# EAGLE design robocoon (EAGLE 9.5.2)
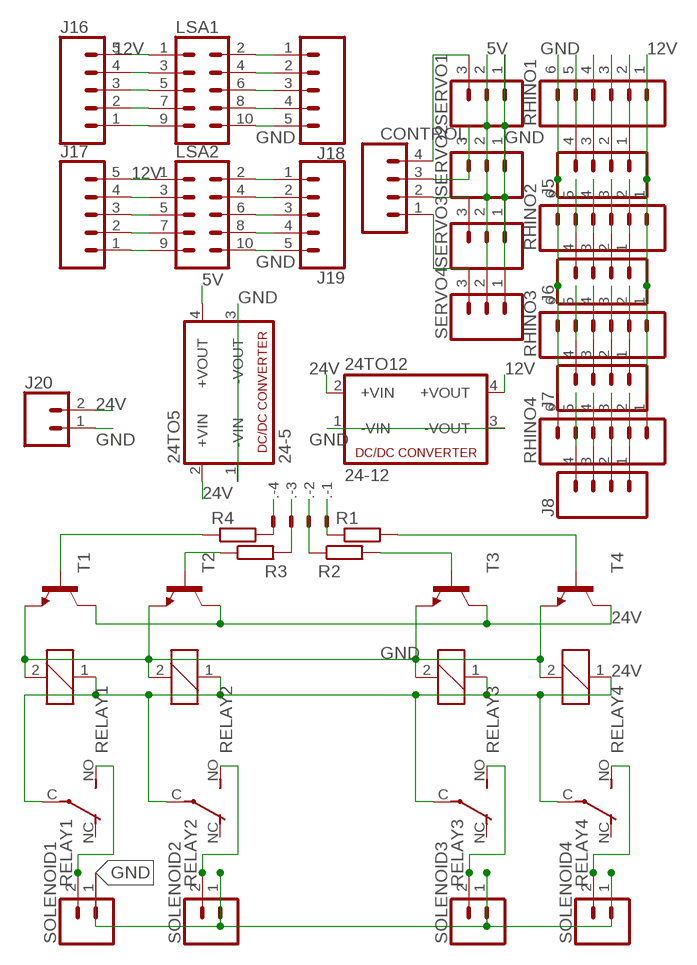
[diagram p0: schematic, sheet 1]

## Parts
24TO5  24-5  NME  [NME]
24TO12  24-12  NME  [NME]
.  22-23-2041  [22-23-2041]
CONTROL  CONN_04  [1X04]
J5  CONN_04  [1X04]
J6  CONN_04  [1X04]
J7  CONN_04  [1X04]
J8  CONN_04  [1X04]
J16  CONN_05SCREW  [SCREWTERMINAL-3.5MM-5]
J17  CONN_05SCREW  [SCREWTERMINAL-3.5MM-5]
J18  CONN_05SCREW  [SCREWTERMINAL-3.5MM-5]
J19  CONN_05SCREW  [SCREWTERMINAL-3.5MM-5]
J20  CONN_023.5MM  [SCREWTERMINAL-3.5MM-2]
LSA1  CONN_05X2PTH  [2X5]
LSA2  CONN_05X2PTH  [2X5]
R1  R-EU_0204/2V  [0204V]
R2  R-EU_0204/2V  [0204V]
R3  R-EU_0204/2V  [0204V]
R4  R-EU_0204/2V  [0204V]
RELAY1  CQ1-12V  [CQ1]
RELAY2  CQ1-12V  [CQ1]
RELAY3  CQ1-12V  [CQ1]
RELAY4  CQ1-12V  [CQ1]
RHINO1  CONN_06NO_SILK_FEMALE_PTH  [1X06_NO_SILK]
RHINO2  CONN_06NO_SILK_FEMALE_PTH  [1X06_NO_SILK]
RHINO3  CONN_06NO_SILK_FEMALE_PTH  [1X06_NO_SILK]
RHINO4  CONN_06NO_SILK_FEMALE_PTH  [1X06_NO_SILK]
SERVO1  CONN_03SCREW  [SCREWTERMINAL-3.5MM-3]
SERVO2  CONN_03SCREW  [SCREWTERMINAL-3.5MM-3]
SERVO3  CONN_03SCREW  [SCREWTERMINAL-3.5MM-3]
SERVO4  CONN_03SCREW  [SCREWTERMINAL-3.5MM-3]
SOLENOID1  CONN_023.5MM  [SCREWTERMINAL-3.5MM-2]
SOLENOID2  CONN_023.5MM  [SCREWTERMINAL-3.5MM-2]
SOLENOID3  CONN_023.5MM  [SCREWTERMINAL-3.5MM-2]
SOLENOID4  CONN_023.5MM  [SCREWTERMINAL-3.5MM-2]
T1  -NPN-TO92  [TO92]
T2  -NPN-TO92  [TO92]
T3  -NPN-TO92  [TO92]
T4  -NPN-TO92  [TO92]

## Nets
5V: 24TO5.4(+VOUT) SERVO1.2 SERVO2.2 SERVO3.2 SERVO4.2
12V: 24TO12.4(+VOUT) J16.5 J17.5 LSA1.1 LSA2.1 RHINO1.1 RHINO2.1 RHINO3.1 RHINO4.1
24V: 24TO5.2(+VIN) 24TO12.2(+VIN) J20.2 RELAY1.1 RELAY1.C(2:P) RELAY2.1 RELAY2.C(2:P) RELAY3.1 RELAY3.C(2:P) RELAY4.1 RELAY4.C(2:P) T1.3(C) T2.3(C) T3.3(C) T4.3(C)
GND: 24TO5.1(-VIN) 24TO5.3(-VOUT) 24TO12.1(-VIN) 24TO12.3(-VOUT) J18.5 J19.5 J20.1 LSA1.10 LSA2.10 RELAY1.2 RELAY2.2 RELAY3.2 RELAY4.2 RHINO1.6 RHINO2.6 RHINO3.6 RHINO4.6 SERVO1.1 SERVO2.1 SERVO3.1 SERVO4.1 SOLENOID1.1 SOLENOID2.1 SOLENOID3.1 SOLENOID4.1 T1.1(E) T2.1(E) T3.1(E) T4.1(E)
N$1: J5.4 RHINO1.5
N$2: J5.3 RHINO1.4
N$3: J5.2 RHINO1.3
N$4: J5.1 RHINO1.2
N$5: J6.4 RHINO2.5
N$6: J6.3 RHINO2.4
N$7: J6.2 RHINO2.3
N$8: J6.1 RHINO2.2
N$9: J7.1 RHINO3.2
N$10: J7.2 RHINO3.3
N$11: J7.3 RHINO3.4
N$12: J7.4 RHINO3.5
N$13: J8.1 RHINO4.2
N$14: J8.2 RHINO4.3
N$15: J8.3 RHINO4.4
N$16: J8.4 RHINO4.5
N$17: CONTROL.4 SERVO1.3
N$18: CONTROL.1 SERVO4.3
N$19: CONTROL.2 SERVO3.3
N$20: CONTROL.3 SERVO2.3
N$25: ..4 R4.2
N$28: ..3 R3.2
N$29: ..2 R2.1
N$30: ..1 R1.1
N$31: J16.1 LSA1.9
N$32: R4.1 T1.2(B)
N$33: R3.1 T2.2(B)
N$34: J16.2 LSA1.7
N$35: R2.2 T3.2(B)
N$36: R1.2 T4.2(B)
N$37: J16.3 LSA1.5
N$38: J16.4 LSA1.3
N$40: J18.1 LSA1.2
N$41: J18.2 LSA1.4
N$43: J18.3 LSA1.6
N$44: J18.4 LSA1.8
N$47: RELAY1.NO(2:S) SOLENOID1.2
N$48: RELAY2.NO(2:S) SOLENOID2.2
N$49: RELAY3.NO(2:S) SOLENOID3.2
N$50: RELAY4.NO(2:S) SOLENOID4.2
N$51: J17.4 LSA2.3
N$52: J17.3 LSA2.5
N$53: J17.2 LSA2.7
N$54: J17.1 LSA2.9
N$55: J19.1 LSA2.2
N$56: J19.2 LSA2.4
N$57: J19.3 LSA2.6
N$58: J19.4 LSA2.8
Unconnected: RELAY1.NC(2:O) RELAY2.NC(2:O) RELAY3.NC(2:O) RELAY4.NC(2:O)

## Library data of the parts
24TO5 24TO12 = dc-dc-converter:NME: DC-DC CONVERTER; MF: C & D TECHNOLOGIES, INC; MPN: NME1205D; OC_FARNELL: 1021466; OC_NEWARK: 98B8198
. = con-molex:22-23-2041: .100" (2.54mm) Center Header - 4 Pin; MF: MOLEX; MPN: 22-23-2041; OC_FARNELL: 1462920; OC_NEWARK: 38C0355
CONTROL J5-J8 = SparkFun-Connectors:CONN_04: Multi connection point. Often used as Generic Header-pin footprint for 0.1 inch spaced/style header connections On any of the 0.1 inch spaced packages, you can populate with these: Break Away Headers - Straight <https://www.sparkfun.com/products/116> (PRT-00116) Break Away Male Headers - Right Angle <https://www.sparkfun.com/products/553> (PRT-00553) Female Headers <https://www.sparkfun.com/products/115> (PRT-00115) Break Away Headers - Machine Pin <https://www.sparkfun.com/products/117> (PRT-00117) Break Away Female Headers - Swiss Machine Pin <https://www.sparkfun.com/products/743> (PRT-00743) For SCREWTERMINALS and SPRING TERMINALS visit here: Screw Terimnals on SparkFun.com <https://www.sparkfun.com/search/results?term=Screw+Terminals> (5mm/3.5mm/2.54mm spacing) This device is also useful as a general connection point to wire up your design to another part of your project. Our various solder wires solder well into these plated through hole pads. Hook-Up Wire - Assortment (Stranded, 22 AWG) <https://www.sparkfun.com/products/11375> (PRT-11375) Hook-Up Wire - Assortment (Solid Core, 22 AWG) <https://www.sparkfun.com/products/11367> (PRT-11367) View the entire wire category on our website here <https://www.sparkfun.com/categories/141> Special notes: Molex polarized connector foot print use with SKU : PRT-08231 with associated crimp pins and housings. 1MM SMD Version SKU: PRT-10208; PROD_ID: CONN-09696
J16-J19 = SparkFun-Connectors:CONN_05: Multi connection point. Often used as Generic Header-pin footprint for 0.1 inch spaced/style header connections On any of the 0.1 inch spaced packages, you can populate with these: Break Away Headers - Straight <https://www.sparkfun.com/products/116> (PRT-00116) Break Away Male Headers - Right Angle <https://www.sparkfun.com/products/553> (PRT-00553) Female Headers <https://www.sparkfun.com/products/115> (PRT-00115) Break Away Headers - Machine Pin <https://www.sparkfun.com/products/117> (PRT-00117) Break Away Female Headers - Swiss Machine Pin <https://www.sparkfun.com/products/743> (PRT-00743) For SCREWTERMINALS and SPRING TERMINALS visit here: Screw Terimnals on SparkFun.com <https://www.sparkfun.com/search/results?term=Screw+Terminals> (5mm/3.5mm/2.54mm spacing) This device is also useful as a general connection point to wire up your design to another part of your project. Our various solder wires solder well into these plated through hole pads. Hook-Up Wire - Assortment (Stranded, 22 AWG) <https://www.sparkfun.com/products/11375> (PRT-11375) Hook-Up Wire - Assortment (Solid Core, 22 AWG) <https://www.sparkfun.com/products/11367> (PRT-11367) View the entire wire category on our website here <https://www.sparkfun.com/categories/141> Special notes: Molex polarized connector foot print use with SKU : PRT-08231 with associated crimp pins and housings. 1MM SMD Version SKU: PRT-10208; PROD_ID: Combine 8288+8399
J20 SOLENOID1-SOLENOID4 = SparkFun-Connectors:CONN_02: Multi connection point. Often used as Generic Header-pin footprint for 0.1 inch spaced/style header connections On any of the 0.1 inch spaced packages, you can populate with these: Break Away Headers - Straight <https://www.sparkfun.com/products/116> (PRT-00116) Break Away Male Headers - Right Angle <https://www.sparkfun.com/products/553> (PRT-00553) Female Headers <https://www.sparkfun.com/products/115> (PRT-00115) Break Away Headers - Machine Pin <https://www.sparkfun.com/products/117> (PRT-00117) Break Away Female Headers - Swiss Machine Pin <https://www.sparkfun.com/products/743> (PRT-00743) For SCREWTERMINALS and SPRING TERMINALS visit here: Screw Terimnals on SparkFun.com <https://www.sparkfun.com/search/results?term=Screw+Terminals> (5mm/3.5mm/2.54mm spacing) This device is also useful as a general connection point to wire up your design to another part of your project. Our various solder wires solder well into these plated through hole pads. Hook-Up Wire - Assortment (Stranded, 22 AWG) <https://www.sparkfun.com/products/11375> (PRT-11375) Hook-Up Wire - Assortment (Solid Core, 22 AWG) <https://www.sparkfun.com/products/11367> (PRT-11367) View the entire wire category on our website here <https://www.sparkfun.com/categories/141> Special notes: Molex polarized connector foot print use with: PRT-08233 with associated crimp pins and housings. 2.54_SCREWTERM for use with PRT-10571. 3.5mm Screw Terminal footprints for PRT-08084 5mm Screw Terminal footprints for use with PRT-08432; PROD_ID: CONN-08399
LSA1 LSA2 = SparkFun-Connectors:CONN_05X2: Multi connection point. Often used as Generic Header-pin footprint for 0.1 inch spaced/style header connections For AVR SPI programming port, see special device with nice symbol: "AVR_SPI_PROG_5x2.dev" You can populate with any combo of single row headers, but if you'd like an exact match, check these: 2x5 AVR ICSP Male Header <https://www.sparkfun.com/products/778> (PRT-00778) 2x5 Pin Shrouded Header <https://www.sparkfun.com/products/8506> (PRT-08506) On any of the 0.1 inch spaced packages, you can populate with these: Break Away Headers - Straight <https://www.sparkfun.com/products/116> (PRT-00116) Break Away Male Headers - Right Angle <https://www.sparkfun.com/products/553> (PRT-00553) Female Headers <https://www.sparkfun.com/products/115> (PRT-00115) Break Away Headers - Machine Pin <https://www.sparkfun.com/products/117> (PRT-00117) Break Away Female Headers - Swiss Machine Pin <https://www.sparkfun.com/products/743> (PRT-00743) Special note: the shrouded connector mates well with our 5x2 ribbon cables: 2x5 Pin IDC Ribbon Cable <https://www.sparkfun.com/products/8535> (PRT-08535); PROD_ID: CONN-08499; SF_ID: PRT-0778
R1-R4 = rcl:R-EU_: RESISTOR, European symbol; SPICEPREFIX: R
RELAY1-RELAY4 = relay:CQ1-12V: AUTOMOTIVE QUIET RELAY NAiS Source: http://www.mew-europe.com/.. en_ds_61208_0000.pdf; OC_FARNELL: unknown; OC_NEWARK: unknown
RHINO1-RHINO4 = SparkFun-Connectors:CONN_06: Multi connection point. Often used as Generic Header-pin footprint for 0.1 inch spaced/style header connections On any of the 0.1 inch spaced packages, you can populate with these: Break Away Headers - Straight <https://www.sparkfun.com/products/116> (PRT-00116) Break Away Male Headers - Right Angle <https://www.sparkfun.com/products/553> (PRT-00553) Female Headers <https://www.sparkfun.com/products/115> (PRT-00115) Break Away Headers - Machine Pin <https://www.sparkfun.com/products/117> (PRT-00117) Break Away Female Headers - Swiss Machine Pin <https://www.sparkfun.com/products/743> (PRT-00743) Arduino Stackable Header - 6 Pin <https://www.sparkfun.com/products/9280> (PRT-09280) For SCREWTERMINALS and SPRING TERMINALS visit here: Screw Terimnals on SparkFun.com <https://www.sparkfun.com/search/results?term=Screw+Terminals> (5mm/3.5mm/2.54mm spacing) This device is also useful as a general connection point to wire up your design to another part of your project. Our various solder wires solder well into these plated through hole pads. Hook-Up Wire - Assortment (Stranded, 22 AWG) <https://www.sparkfun.com/products/11375> (PRT-11375) Hook-Up Wire - Assortment (Solid Core, 22 AWG) <https://www.sparkfun.com/products/11367> (PRT-11367) View the entire wire category on our website here <https://www.sparkfun.com/categories/141>; PROD_ID: CONN-08437
SERVO1-SERVO4 = SparkFun-Connectors:CONN_03: Multi connection point. Often used as Generic Header-pin footprint for 0.1 inch spaced/style header connections On any of the 0.1 inch spaced packages, you can populate with these: Break Away Headers - Straight <https://www.sparkfun.com/products/116> (PRT-00116) Break Away Male Headers - Right Angle <https://www.sparkfun.com/products/553> (PRT-00553) Female Headers <https://www.sparkfun.com/products/115> (PRT-00115) Break Away Headers - Machine Pin <https://www.sparkfun.com/products/117> (PRT-00117) Break Away Female Headers - Swiss Machine Pin <https://www.sparkfun.com/products/743> (PRT-00743) Stackable Header - 3 Pin (Female, 0.1") <https://www.sparkfun.com/products/13875> (PRT-13875) For SCREWTERMINALS and SPRING TERMINALS visit here: Screw Terimnals on SparkFun.com <https://www.sparkfun.com/search/results?term=Screw+Terminals> (5mm/3.5mm/2.54mm spacing) This device is also useful as a general connection point to wire up your design to another part of your project. Our various solder wires solder well into these plated through hole pads. Hook-Up Wire - Assortment (Stranded, 22 AWG) <https://www.sparkfun.com/products/11375> (PRT-11375) Hook-Up Wire - Assortment (Solid Core, 22 AWG) <https://www.sparkfun.com/products/11367> (PRT-11367) View the entire wire category on our website here <https://www.sparkfun.com/categories/141> Special notes: Molex polarized connector foot print use with SKU : PRT-08232 with associated crimp pins and housings.; PROD_ID: CONN-08288; SF_ID: PRT-08235
T1-T4 = transistor:*-NPN-: NPN Transistror BF959 corrected 2008.03.06

## Board
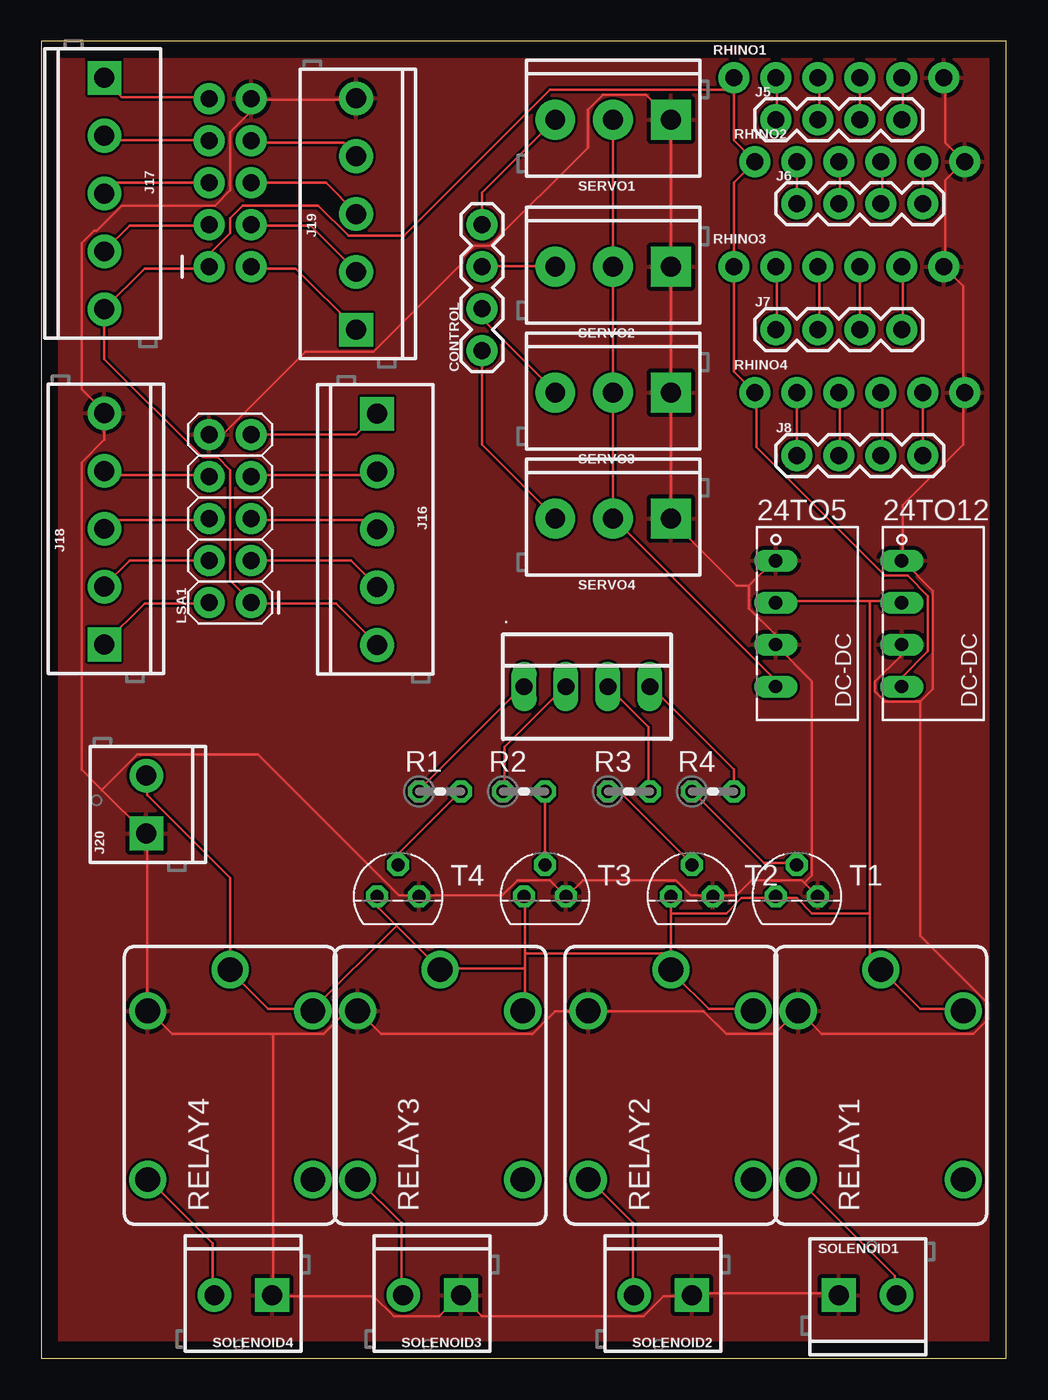
[diagram p1: board, top side]
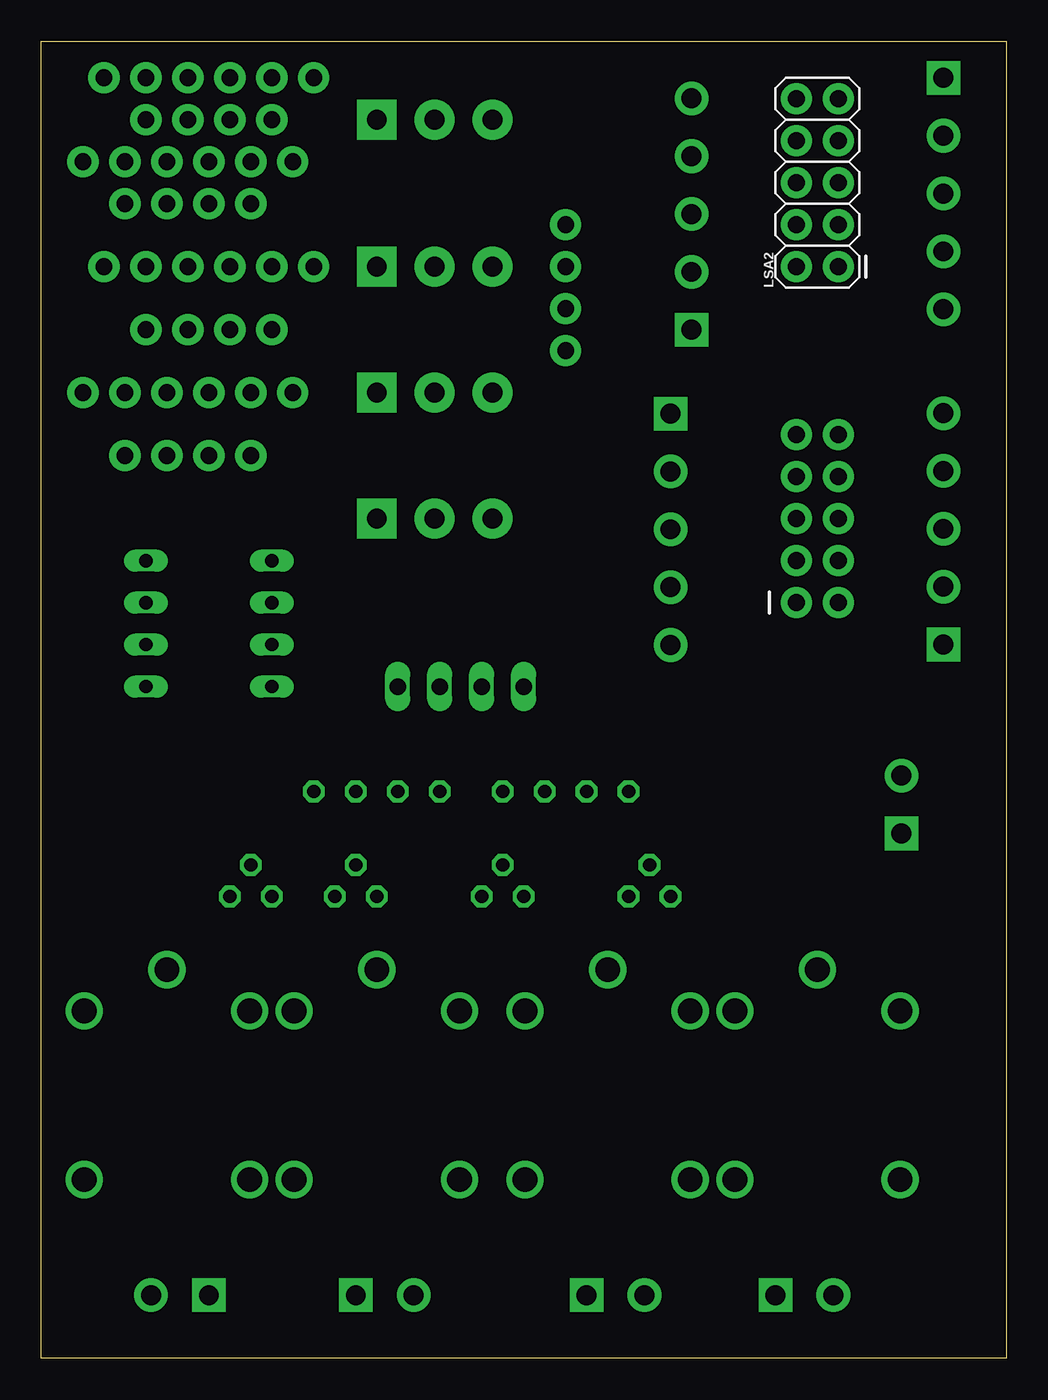
[diagram p2: board, bottom side, seen from below]

Size 58.4 x 79.68 mm. Coordinates in mm from the lower left corner, seen from the top.
Outline: 0,0 58.4,0 58.4,79.68 0,79.68 0,0
Copper layers (1*16): Top 0.035mm / dielectric 1.5mm / Bottom 0.035mm
Design rules "default": minimum track width 6mil, minimum drill 0.35mm, track to track 6mil, track to pad 6mil, pad to pad 6mil, via to via 6mil, smd to smd 6mil, copper to edge 40mil, drill to drill 6mil, minimum pad ring 10mil, minimum via ring 8mil, stop-mask expansion 4mil, vias tented up to drill 0mil, thermal gap 10mil

### Footprints (pad centres in the part's own frame; a part is rotated, then mirrored left to right if it is on the bottom)
NME = drill 0.813 long: 1 0,3.81; 2 0,1.27; 3 0,-1.27; 4 0,-3.81
22-23-2041 = drill 1 long: 1 -3.81,0; 2 -1.27,0; 3 1.27,0; 4 3.81,0
1X04 = drill 1.016 pad 1.88: 1 0,0; 2 2.54,0; 3 5.08,0; 4 7.62,0
SCREWTERMINAL-3.5MM-5 = drill 1.2 pad 2.032 square: 1 0,0 | drill 1.2 pad 2.032: 2 3.5,0; 3 7,0; 4 10.5,0; 5 14,0
SCREWTERMINAL-3.5MM-2 = drill 1.2 pad 2.032 square: 1 0,0 | drill 1.2 pad 2.032: 2 3.5,0
2X5 = drill 1.016 pad 1.88: 1 0,0; 2 0,2.54; 3 2.54,0; 4 2.54,2.54; 5 5.08,0; 6 5.08,2.54; 7 7.62,0; 8 7.62,2.54; 9 10.16,0; 10 10.16,2.54
0204V = drill 0.813 octagon: 1 -1.27,0; 2 1.27,0
CQ1 = drill 1.5: 1 4.5,-5; 2 4.5,5; C 7,0; NC -5.7,-5; NO -5.7,5
1X06_NO_SILK = drill 1.016 pad 1.88: 1 0,0; 2 2.54,0; 3 5.08,0; 4 7.62,0; 5 10.16,0; 6 12.7,0
SCREWTERMINAL-3.5MM-3 = drill 1.2 pad 2.413 square: 1 0,0 | drill 1.2 pad 2.413: 2 3.5,0; 3 7,0
TO92 = drill 0.813 octagon: 1 1.27,0; 2 0,1.905; 3 -1.27,0

### Placement (x,y rotation side)
24TO5  44.45,44.45 0 top
24TO12  52.07,44.45 0 top
.  33.02,40.64 0 top
CONTROL  26.67,60.96 90 top
J5  44.45,74.93 0 top
J6  45.72,69.85 0 top
J7  44.45,62.23 0 top
J8  45.72,54.61 0 top
J16  20.32,57.15 270 top
J17  3.81,77.47 270 top
J18  3.81,43.18 90 top
J19  19.05,62.23 90 top
J20  6.35,31.75 90 top
LSA1  12.7,45.72 90 top
LSA2  10.16,66.04 90 bottom
R1  24.13,34.29 0 top
R2  29.21,34.29 0 top
R3  35.56,34.29 0 top
R4  40.64,34.29 0 top
RELAY1  50.8,16.51 90 top
RELAY2  38.1,16.51 90 top
RELAY3  24.13,16.51 90 top
RELAY4  11.43,16.51 90 top
RHINO1  41.91,77.47 0 top
RHINO2  43.18,72.39 0 top
RHINO3  41.91,66.04 0 top
RHINO4  43.18,58.42 0 top
SERVO1  38.1,74.93 180 top
SERVO2  38.1,66.04 180 top
SERVO3  38.1,58.42 180 top
SERVO4  38.1,50.8 180 top
SOLENOID1  48.26,3.81 0 top
SOLENOID2  39.37,3.81 180 top
SOLENOID3  25.4,3.81 180 top
SOLENOID4  13.97,3.81 180 top
T1  45.72,27.94 0 top
T2  39.37,27.94 0 top
T3  30.48,27.94 0 top
T4  21.59,27.94 0 top

### Tracks (layer width: path | path; a pad name or v marks a point on that pad's centre or on a via)
5V
  Top 0.152: SERVO1.2 34.59,66.09 SERVO2.2 34.59,65.94 34.59,58.47 SERVO3.2 34.59,58.32 34.59,50.85 SERVO4.2 34.75,50.7 44.35,41.1 44.35,40.64 24TO5.4
12V
  Top 0.152: J16.5 20.27,43.23 17.83,45.67 12.8,45.67 LSA1.1 12.65,45.82 11.43,47.04 11.43,53.75 10.67,54.51 9.75,54.51 3.81,60.45 J17.5 3.81,63.5 6.25,65.94 10.06,65.94 LSA2.1 10.21,66.09 10.21,66.85 11.43,68.07 11.43,68.99 12.19,69.75 16.76,69.75 18.59,67.92 21.95,67.92 30.78,76.76 41.91,76.76 | 41.91,76.76 41.91,73.71 43.13,72.49 RHINO2.1 41.91,71.12 RHINO3.1 41.91,59.69 RHINO4.1 43.28,58.32 43.28,55.12 51.05,47.35 52.43,47.35 53.65,46.13 53.65,42.77 52.12,41.25 52.12,40.64 24TO12.4 | 41.91,76.76 RHINO1.1
24V
  Top 0.152: 21.49,26.16 24.08,23.57 RELAY3.C 24.23,23.57 29.26,23.57 | 21.49,26.16 20.42,27.23 20.42,27.84 T4.3 | 29.26,23.57 29.26,21.13 RELAY3.1 | 29.26,23.57 29.26,24.49 | 29.26,24.49 29.26,27.84 T3.3 | J20.2 6.4,35.15 6.4,34.09 11.43,29.06 RELAY4.C 11.43,23.42 13.72,21.13 16.31,21.13 RELAY4.1 16.46,21.13 21.49,26.16 | 38.1,24.49 RELAY2.C 38.38,23.23 38.38,23.14 40.39,21.13 42.98,21.13 RELAY2.1 | 38.1,24.49 38.1,26.92 | 38.1,26.92 T2.3 | 38.1,26.92 41.45,26.92 42.37,27.84 44.35,27.84 T1.3 44.5,27.84 45.72,27.84 46.63,26.92 50.14,26.92 | 50.14,45.82 51.97,45.82 24TO12.2 | 50.14,45.82 44.5,45.82 24TO5.2 | RELAY1.1 55.78,21.13 53.19,21.13 50.9,23.42 RELAY1.C 50.75,23.57 50.14,24.18 50.14,26.92 | 50.14,26.92 50.14,45.82 | 38.1,24.49 29.26,24.49
GND
  Top 0.152: LSA1.10 10.97,55.88 16,60.91 20.12,60.91 25.45,66.24 25.45,66.55 26.21,67.31 27.13,67.31 33.07,73.25 33.07,75.54 33.98,76.45 36.58,76.45 SERVO1.1 SERVO2.1 SERVO3.1 SERVO4.1 38.1,50.7 42.06,46.74 42.82,46.74 | T1.1 46.18,28.75 | 46.18,28.75 46.02,28.91 42.98,28.91 42.06,27.99 40.69,27.99 T2.1 40.54,27.99 39.32,27.99 38.41,28.91 32.77,28.91 31.85,27.99 T3.1 30.78,28.91 28.8,28.91 27.89,27.99 22.86,27.99 | 42.82,46.74 42.82,45.36 44.35,43.84 44.35,43.23 24TO5.3 44.5,43.08 46.63,40.95 46.63,29.21 46.18,28.75 | 42.82,46.74 44.35,48.26 24TO5.1 | 53.19,39.73 51.05,39.73 50.44,40.34 50.44,40.95 51.97,42.47 51.97,43.08 24TO12.3 | 53.19,39.73 53.95,40.49 53.95,46.43 52.12,48.26 | RHINO1.6 54.71,77.37 54.71,73.56 RHINO2.6 55.78,72.34 54.71,71.27 54.71,66.09 RHINO3.6 55.78,64.87 55.78,58.47 RHINO4.6 55.78,58.32 55.78,55.27 52.12,51.61 52.12,48.26 | 52.12,48.26 24TO12.1 | SOLENOID1.1 48.16,3.91 39.47,3.91 SOLENOID2.1 39.32,3.76 37.64,3.76 36.42,2.54 26.67,2.54 SOLENOID3.1 25.3,3.76 24.08,2.54 21.34,2.54 20.12,3.76 14.02,3.76 SOLENOID4.1 14.02,3.91 14.02,19.61 | J19.5 19.05,76.15 12.8,76.15 LSA2.10 12.65,76.15 12.65,75.39 11.43,74.17 11.43,70.66 10.52,69.75 4.88,69.75 3.35,68.22 3.2,68.22 2.44,67.46 2.44,58.62 3.81,57.25 J18.5 3.81,55.57 2.44,54.2 2.44,35.61 3.66,34.39 | 3.66,34.39 6.25,31.8 J20.1 6.4,31.65 6.4,21.13 RELAY4.2 6.55,20.98 7.92,19.61 14.02,19.61 | 14.02,19.61 17.07,19.61 18.44,20.98 19.05,20.98 RELAY3.2 19.2,20.98 20.57,19.61 29.72,19.61 31.09,20.98 33.07,20.98 RELAY2.2 33.22,20.98 40.08,20.98 41.45,19.61 44.35,19.61 45.72,20.98 RELAY1.2 45.87,20.98 47.24,19.61 56.39,19.61 57.3,20.52 57.3,21.44 53.19,25.55 53.19,39.73
  Top 0.152: 22.86,27.99 21.64,27.99 13.11,36.52 5.79,36.52 3.66,34.39 | 22.86,27.99 T4.1
  pour Top: -2.54,81.28 -2.54,-2.54 60.96,-2.54 60.96,81.28
N$1
  Top 0.152: J5.4 52.12,74.93 52.12,77.37 RHINO1.5
N$2
  Top 0.152: RHINO1.4 J5.3
N$3
  Top 0.152: J5.2 47.09,74.93 47.09,77.37 RHINO1.3
N$4
  Top 0.152: J5.1 44.5,74.93 44.5,77.37 RHINO1.2
N$5
  Top 0.152: RHINO2.5 J6.4
N$6
  Top 0.152: J6.3 50.9,69.9 50.9,72.34 RHINO2.4
N$7
  Top 0.152: J6.2 48.31,69.9 48.31,72.34 RHINO2.3
N$8
  Top 0.152: RHINO2.2 J6.1
N$9
  Top 0.152: J7.1 44.5,62.28 44.5,65.94 RHINO3.2
N$10
  Top 0.152: J7.2 47.09,62.28 47.09,65.94 RHINO3.3
N$11
  Top 0.152: RHINO3.4 J7.3
N$12
  Top 0.152: J7.4 52.12,62.28 52.12,65.94 RHINO3.5
N$13
  Top 0.152: RHINO4.2 J8.1
N$14
  Top 0.152: J8.2 48.31,54.66 48.31,58.32 RHINO4.3
N$15
  Top 0.152: J8.3 50.9,54.66 50.9,58.32 RHINO4.4
N$16
  Top 0.152: RHINO4.5 J8.4
N$17
  Top 0.152: CONTROL.4 26.67,70.51 SERVO1.3
N$18
  Top 0.152: CONTROL.1 26.67,55.27 31.09,50.85 SERVO4.3
N$19
  Top 0.152: CONTROL.2 26.67,62.89 31.09,58.47 SERVO3.3
N$20
  Top 0.152: CONTROL.3 26.67,66.09 31.09,66.09 SERVO2.3
N$25
  Top 0.152: R4.2 41.91,35.61 36.88,40.64 ..4
N$28
  Top 0.152: ..3 36.73,38.2 36.73,34.39 R3.2
N$29
  Top 0.152: R2.1 28.04,34.39 28.04,36.98 31.7,40.64 ..2
N$30
  Top 0.152: R1.1 22.86,34.39 29.11,40.64 ..1
N$31
  Top 0.152: LSA1.9 19.05,55.88 J16.1
N$32
  Top 0.152: T1.2 45.72,29.97 43.74,29.97 39.47,34.24 R4.1
N$33
  Top 0.152: R3.1 34.29,34.24 35.05,34.24 39.32,29.97 T2.2
N$34
  Top 0.152: LSA1.7 12.8,53.44 20.12,53.44 20.27,53.59 J16.2
N$35
  Top 0.152: R2.2 T3.2
N$36
  Top 0.152: T4.2 21.64,29.97 21.64,30.58 25.3,34.24 R1.2
N$37
  Top 0.152: LSA1.5 12.8,50.7 19.81,50.7 20.27,50.24 J16.3
N$38
  Top 0.152: LSA1.3 18.74,48.26 20.27,46.74 J16.4
N$40
  Top 0.152: LSA1.2 10.06,45.67 6.25,45.67 3.81,43.23 J18.1
N$41
  Top 0.152: LSA1.4 5.33,48.26 3.81,46.74 J18.2
N$43
  Top 0.152: LSA1.6 10.06,50.7 4.27,50.7 3.81,50.24 J18.3
N$44
  Top 0.152: LSA1.8 10.06,53.44 3.96,53.44 3.81,53.59 J18.4
N$47
  Top 0.152: SOLENOID1.2 51.66,3.91 51.66,4.98 45.87,10.77 RELAY1.NO
N$48
  Top 0.152: SOLENOID2.2 35.81,3.91 35.81,8.18 33.22,10.77 RELAY2.NO
N$49
  Top 0.152: SOLENOID3.2 21.79,3.91 21.79,8.18 19.2,10.77 RELAY3.NO
N$50
  Top 0.152: SOLENOID4.2 10.36,3.91 10.36,6.96 6.55,10.77 RELAY4.NO
N$51
  Top 0.152: LSA2.3 10.06,68.53 5.33,68.53 3.81,67 J17.4
N$52
  Top 0.152: LSA2.5 4.42,71.12 3.81,70.51 J17.3
N$53
  Top 0.152: LSA2.7 10.06,73.71 3.96,73.71 3.81,73.86 J17.2
N$54
  Top 0.152: LSA2.9 10.06,76.3 4.88,76.3 3.81,77.37 J17.1
N$55
  Top 0.152: LSA2.2 12.8,65.94 15.39,65.94 19.05,62.28 J19.1
N$56
  Top 0.152: LSA2.4 12.8,68.53 16.31,68.53 19.05,65.79 J19.2
N$57
  Top 0.152: LSA2.6 17.22,71.12 19.05,69.29 J19.3
N$58
  Top 0.152: LSA2.8 12.8,73.56 18.29,73.56 19.05,72.8 J19.4